# EAGLE schematic noninverting_amplifier (EAGLE 6.4)
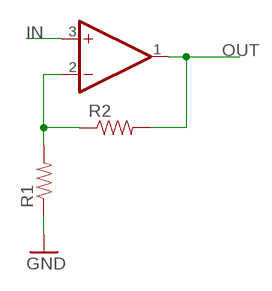
[diagram p0: schematic, sheet 1]

## Parts
IC1  MCP6022  [SOIC8_150MIL]
R1  RESISTOR0402-RES  [0402-RES]
R2  RESISTOR0402-RES  [0402-RES]

## Nets
GND: R1.1
IN: IC1.3(+IN)
N$1: IC1.2(-IN) R1.2 R2.1
OUT: IC1.1(OUT) R2.2
Unconnected: IC1.4(-) IC1.5(+IN) IC1.6(-IN) IC1.7(OUT) IC1.8(+)

## Library data of the parts
IC1 = microbuilder:MCP6022: MCP6022 - Dual Rail-to-Rail 10MHz Op-Amp Digikey: SOIC8 - MCP6022-I/SN-ND
R1 R2 = SparkFun-Passives:RESISTOR: Resistor Basic schematic elements and footprints for 0603, 1206, and PTH resistors.